# Altium schematic sheet mHealth.SchDoc
size Letter; SheetNumber: 1
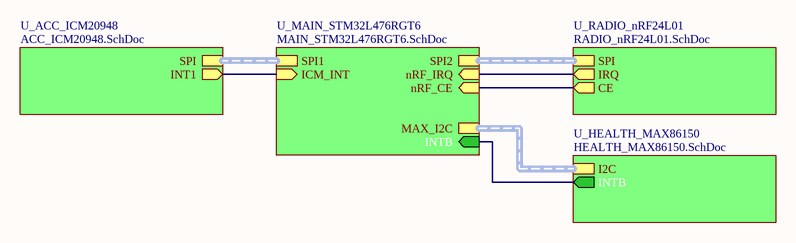
[diagram p0: mHealth.SchDoc]

## Sub-sheets
U_ACC_ICM20948 = ACC_ICM20948.SchDoc: SPI (harness SPI), INT1 (out)
U_HEALTH_MAX86150 = HEALTH_MAX86150.SchDoc: I2C (harness I2C), INTB (out)
U_MAIN_STM32L476RGT6 = MAIN_STM32L476RGT6.SchDoc: nRF_IRQ (in), INTB (in), MAX_I2C (harness I2C), ICM_INT (in), SPI2 (harness SPI), nRF_CE (in), SPI1 (harness SPI)
U_RADIO_nRF24L01 = RADIO_nRF24L01.SchDoc: IRQ (out), CE (out), SPI (harness SPI)

## Nets
(unnamed): sheet U_MAIN_STM32L476RGT6/nRF_IRQ, sheet U_RADIO_nRF24L01/IRQ
(unnamed): sheet U_MAIN_STM32L476RGT6/INTB, sheet U_HEALTH_MAX86150/INTB
(unnamed): sheet U_MAIN_STM32L476RGT6/ICM_INT, sheet U_ACC_ICM20948/INT1
(unnamed): sheet U_MAIN_STM32L476RGT6/nRF_CE, sheet U_RADIO_nRF24L01/CE

## Buses and harness runs
harness sheet U_ACC_ICM20948/SPI = sheet U_MAIN_STM32L476RGT6/SPI1
harness sheet U_HEALTH_MAX86150/I2C = sheet U_MAIN_STM32L476RGT6/MAX_I2C
harness sheet U_MAIN_STM32L476RGT6/SPI2 = sheet U_RADIO_nRF24L01/SPI